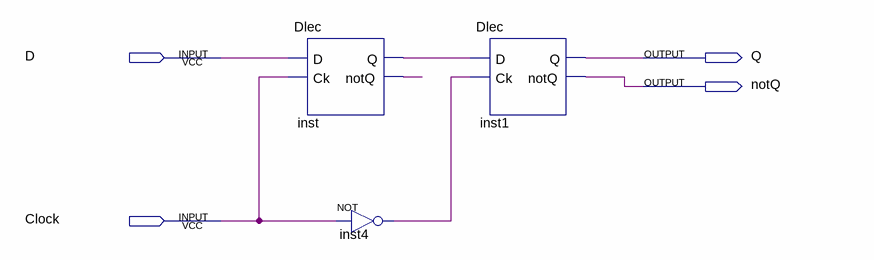
[diagram p0: schematic sheet]
// Quartus schematic DMSff.bdf as structural Verilog: 3 symbols, 4 pins
module DMSff (
  input  D,
  input  Clock,
  output Q,
  output notQ
);

  wire inst4_out, inst_notq, inst_q;

  Dlec inst (.D(D), .Ck(Clock), .Q(inst_q), .notQ(inst_notq));
  not inst4 (inst4_out, Clock);
  Dlec inst1 (.D(inst_q), .Ck(inst4_out), .Q(Q), .notQ(notQ));
endmodule
